# Altium schematic sheet PowerSupply.SchDoc
size A; SheetNumber: 2; SheetTotal: 5
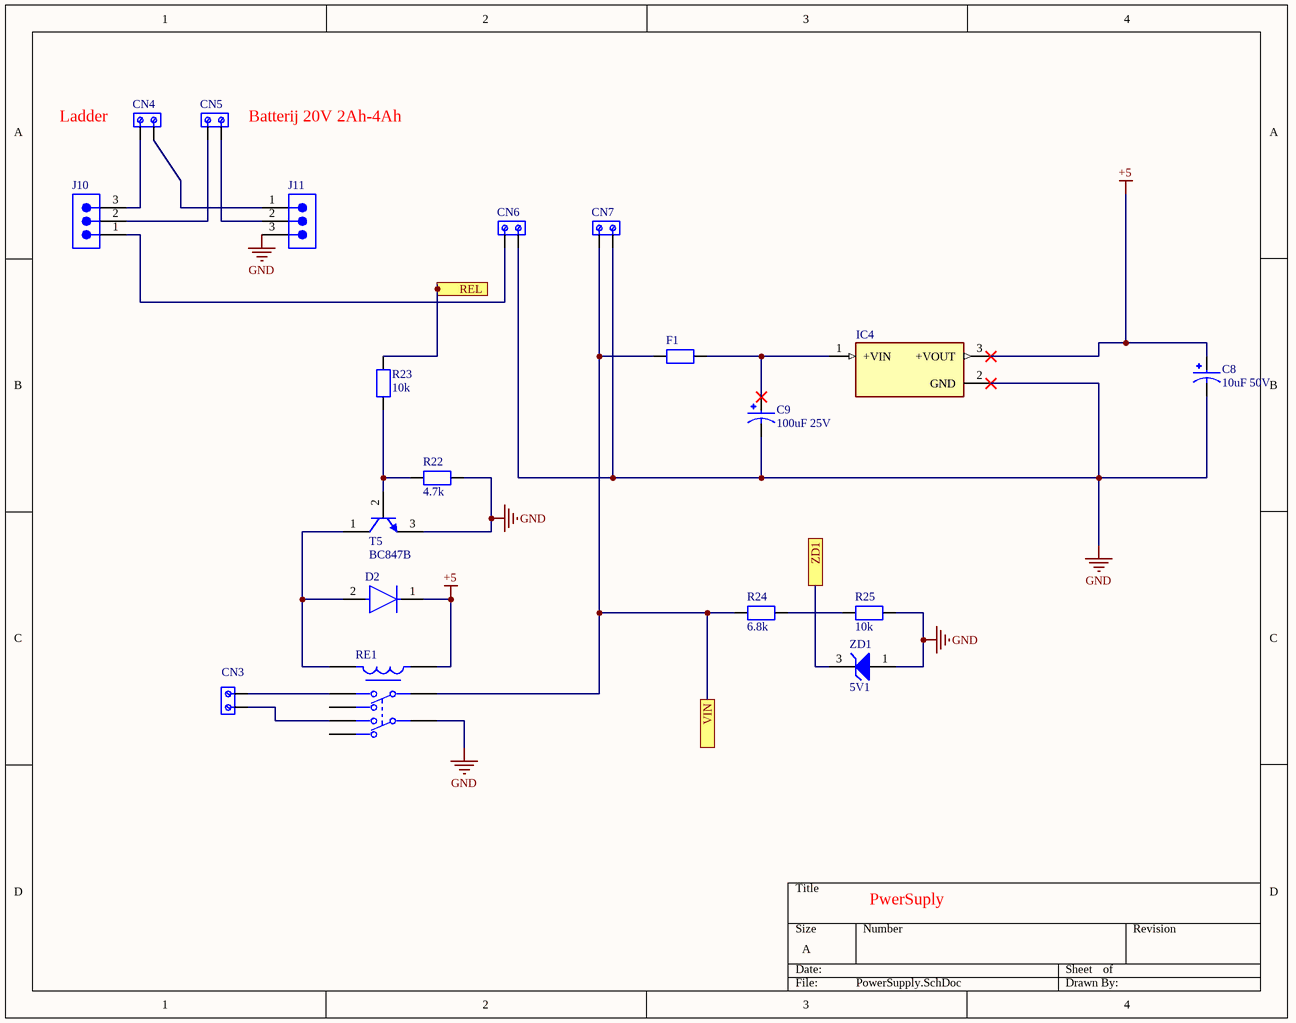
[diagram p0: PowerSupply.SchDoc]

## Parts
C8  10uF 50V  [CAPPRD350W60D800H1150]
C9  100uF 25V  [CAPPRD500W50D500H1100]
CN3  connecters 2pins  [conncecto 2 pins]  (value not drawn)
CN4  connecters 2pins  [conncecto 2 pins]  (value not drawn)
CN5  connecters 2pins  [conncecto 2 pins]  (value not drawn)
CN6  connecters 2pins  [conncecto 2 pins]  (value not drawn)
CN7  connecters 2pins  [conncecto 2 pins]  (value not drawn)
D2  1N4007  [FP-SOD323F-MFG]  (value not drawn)
F1  RES_0805  [RES_0805]  (value not drawn)
IC4  DC/DC converters  [CONV_TSR_1-2450E]  (value not drawn)
J10  61300311121  [61300311121]  (value not drawn)
J11  61300311121  [61300311121]  (value not drawn)
R22  4.7k  [RES_0805]
R23  10k  [RES_0805]
R24  6.8k  [RES_0805]
R25  10k  [RES_0805]
RE1  RT424005F  [FP-RT424005F-MFG]  (value not drawn)
T5  BC847B  [ONSC-TO-92-3-29-11]
ZD1  5V1  [ONSC-SOT-23-3-318-08_V]

## Ports
REL (see CPU[1C]), VIN (see PWU[2B]), ZD1 (see CPU[2B])

## Nets
+5: C8.P D2.1(C) IC4.3(+VOUT) RE1.A1
GND: C8.N C9.N CN6.2 CN7.2 IC4.2(GND) J11.3 R22.2 R25.2 RE1.21 T5.3(E) ZD1.1(A)
REL: R23.2 ; port REL
VIN: CN7.1 F1.1 R24.1 RE1.11 ; port VIN
ZD1: ZD1.3(K) ; port ZD1
NetC9_P: C9.P F1.2 IC4.1(+VIN)
NetCN3_1: CN3.1 RE1.24
NetCN3_2: CN3.2 RE1.14
NetCN4_1: CN4.1 J10.3
NetCN4_2: CN4.2 J11.1
NetCN5_1: CN5.1 J10.2
NetCN5_2: CN5.2 J11.2
NetCN6_1: CN6.1 J10.1
NetD2_2: D2.2(A) RE1.A2 T5.1(C)
NetR22_1: R22.1 R23.1 T5.2(B)
NetR24_2: R24.2 R25.1

Not connected (* = marked no-connect by the designer): RE1 12 22

## Notes on the sheet
- (near CN4) Ladder
- (near CN5) Batterij 20V 2Ah-4Ah
- PwerSuply

## Library data of the parts
C8 = Capacitor: Capacitor 100 μF, 50 V, steek 3,5 mm, 8x11 mm, generic.
C9 = Capacitor_1: Capacitor, 10 μF, 50 V, steek 2 mm, 5x11 mm, generic.
CN3-CN7 = pins: printkroonsteen 5,08 mm,
D2 = 1N4148WSF-7: Rectifier Diode, 1 Phase, 1 Element, 0.25A, 100V V(RRM), Silicon; Manufacturer: Diodes; Package Body Material: Plastic; Number of Elements: 1; Max Output current: 250mA; Max Power Dissipation: 400mW; Reverse Recovery Time-Max: 0.004us; Supplier: Future Electronics; Supplier Part Number: 4050038; Manufacturer Part Number: 1N4148WSF-7; RoHS: Yes; Category: Rectifier Diodes; Stock: 36000; Pricing: 3000=0.0178, 12000=0.0171, 45000=0.0164, 90000=0.0161, 225000=0.0153 (USD); Pins: 2; Diode Element Material: SILICON; Package Shape: Rectangular; Terminal Finish: Tin; Min Operating Temperature: -55°C; Max Operating Temperature: 150°C; JESD-609 Code: e3; Diode Type: RECTIFIER; JESD-30 Code: R-PDSO-F2; Package Style: SMALL OUTLINEMeter; Rep Pk Reverse Voltage-Max: 100V; Surface Mount: Yes; Terminal Form: Flat; Terminal Position: DUAL; Reach SVHC Compliant: Yes; RoHS Compliant: Yes; ComponentLink1URL: https://datasheet.ciiva.com:443/pdfs/VipMasterIC/IC/DIOD/DIODS20288/DIODS20288-1.pdf?src-supplier=IHS+Markit; ComponentLink1Description: https://datasheet.ciiva.com:443/pdfs/VipMasterIC/IC/DIOD/DIODS20288/DIODS20288-1.pdf?src-supplier=IHS+Markit; ComponentLink2URL: https://datasheet.ciiva.com/29592/1n4148wsf-29592065.pdf?src-supplier=Digikey; ComponentLink2Description: https://datasheet.ciiva.com/29592/1n4148wsf-29592065.pdf?src-supplier=Digikey
F1 R22-R25 = RES_0805: SMD size 0805 Generic.; Manufacturer: *; Manufacture Part N: *; Tolerence: *; Package Size: *; Voltage Rating: *
J10 J11 = 61300311121: Board Connector, 3 Contact(s), 1 Row(s), Male, Straight, 0.1 inch Pitch, Solder Terminal, Locking, Black Insulator, Plug; Manufacturer: Wurth Electronics; Contact Pattern: RECTANGULAR; Contact Resistance: 20mR; Contact Style: SQ PIN-SKT; Dielectric Withstanding Voltage (AC): 500V; Insulation Resistance: 1GR; Number Of Connectors: 1; Rated Current (Signal): 3A; Number of Contacts: 3; Body Length: 0.3inch; Reference Standard: UL; Reliability: COMMERCIAL; Supplier: Rs; Supplier Part Number: 8281585P; Manufacturer Part Number: 61300311121; RoHS: Yes; Category: Connectors; Stock: 3960; Pricing: 25=0.11, 50=0.088, 100=0.082, 250=0.078 (EUR); Mounting Technology: Board; Contact Material: Copper Alloy; Contact Finish - Mating: GOLD; Contact Finish - Termination: Gold (Au) - with Nickel (Ni) barrier; Insulation Color: Black; Insulation Material: Polybutylene; Min Operating Temperature: -40°C; Max Operating Temperature: 125°C; Connector Type: BOARD CONNECTOR; JESD-609 Code: e4; Body/Shell Style: PLUG; Contact Gender: Male; Mounting Style: STRAIGHT; Number of Rows Loaded: 1; PCB Contact Pattern: RECTANGULAR; Termination: Solder; Body Breadth: 0.1inch; Body Depth: 0.1inch; Mating Contact Pitch: 0.1inch; Mounting Option 1: LOCKING; Terminal Length: 0.118inch; Terminal Pitch: 2.54mm; Reach SVHC Compliant: Yes; RoHS Compliant: Yes; ComponentLink1URL: https://datasheet.ciiva.com:443/pdfs/VipMasterIC/IC/MIDC/MIDCS07676/MIDCS07676-1.pdf?src-supplier=IHS+Markit; ComponentLink1Description: https://datasheet.ciiva.com:443/pdfs/VipMasterIC/IC/MIDC/MIDCS07676/MIDCS07676-1.pdf?src-supplier=IHS+Markit; ComponentLink2URL: http://www.farnell.com/cad/1737268.pdf?src-supplier=Element14; ComponentLink2Description: http://www.farnell.com/cad/1737268.pdf?src-supplier=Element14; ComponentLink3URL: https://datasheet.octopart.com/61300311121-W%C3%BCrth-Elektronik-datasheet-21154836.pdf?src-supplier=Element14; ComponentLink3Description: https://datasheet.octopart.com/61300311121-W%C3%BCrth-Elektronik-datasheet-21154836.pdf?src-supplier=Element14; ComponentLink4URL: https://katalog.we-online.de/em/datasheet/6130xx11121.pdf?src-supplier=Digikey; ComponentLink4Description: https://katalog.we-online.de/em/datasheet/6130xx11121.pdf?src-supplier=Digikey
RE1 = RT424005F: Power/Signal Relay, 2 Form C, DPDT, Momentary, 0.08A (Coil), 5VDC (Coil), 400mW (Coil), 8A (Contact), 30VDC (Contact), DC Input, Random, AC Output, Through Hole-Straight Mount; Manufacturer: TE Connectivity; End Contact Material: Agni90/10; Coil Current(DC)-Max: 80mA; Coil Operate Voltage(DC): 3.5V; Coil Release Voltage(DC): 500mV; Coil Resistance: 62R; Coil Voltage(DC)-Max: 5V; Contact AC Max Power Rating R Load: 2000VA@400VAC; Contact AC Max Rating R Load: 8A@250VAC; Contact DC Max Rating R Load: 8A@30VDC; Contact Voltage(AC)-Max: 250V; Contact Voltage(DC)-Max: 30V; Dielectric Strength Between Coil and Contacts: 5000Vrms; Dielectric Strength Between Open Contacts: 1000Vrms; Electrical Life: 30000Cycles; Operate Time: 15ms; PCB Hole Count: 8; Relay Form: 2 FORM C; Release Time: 6ms; Body Breadth: 12.7inch; Body Height: 15.7mm; Body Length or Diameter: 29mm; Reference Standard: UL; Sealing: FLUX FREE SEALED; Supplier: Avnet; Supplier Part Number: 17C6452; Manufacturer Part Number: RT424005F; RoHS: Yes; Category: Power Relays; Stock: 1500; Pricing: 1=6.31, 10=5.95, 25=5.33, 50=5.1, 100=4.86 (USD); Mounting Technology: Through Hole; Pins: 8; Weight: 13g; Min Operating Temperature: -40°C; Max Operating Temperature: 85°C; Coil Power: 400mW; Coil Voltage-Nom: 5V; Coil/Input Supply Type: DC; Contact Current(AC)-Max: 8A; Contact Current(DC)-Max: 8A; Contact/Output Supply Type: AC; Input Switching Control Type: Random; Packaging: Box; Relay Action: MOMENTARY; Relay Function: DPDT; Relay Type: POWER/SIGNAL RELAY; Termination: Solder; Terminal Length: 0.0036inch; Reach SVHC Compliant: Yes; RoHS Compliant: Yes; ComponentLink1URL: https://datasheet.ciiva.com:443/pdfs/VipMasterIC/IC/TYEL/TYEL-S-A0008743874/TYEL-S-A0008744021-1.pdf?src-supplier=IHS+Markit; ComponentLink1Description: https://datasheet.ciiva.com:443/pdfs/VipMasterIC/IC/TYEL/TYEL-S-A0008743874/TYEL-S-A0008744021-1.pdf?src-supplier=IHS+Markit; ComponentLink2URL: https://datasheet.ciiva.com/2408/eng-ds-rt2pb-0411-2408708.pdf?src-supplier=Digikey; ComponentLink2Description: https://datasheet.ciiva.com/2408/eng-ds-rt2pb-0411-2408708.pdf?src-supplier=Digikey
T5 = BC547CG: Small Signal Bipolar Transistor, 0.1A I(C), 45V V(BR)CEO, 1-Element, NPN, Silicon, TO-92; Manufacturer: ON Semiconductor; Package Body Material: Plastic; Max Collector Current: 100mA; DC Current Gain-Min (hFE): 420; Number of Elements: 1; Power Dissipation-Max (Abs): 625mW; Surface Mount: No; Time @ Peak Reflow Temperature-Max (s): 40s; Transistor Application: AMPLIFIER; Frequency: 300MHz; Qualification Status: Not Qualified; Supplier: Arrow Electronics; Supplier Part Number: BC547CG; Manufacturer Part Number: BC547CG; RoHS: Yes; Category: BJTs; Stock: 41483; Pricing: 1=0.214, 25=0.189, 100=0.169, 500=0.16, 1000=0.107, 2500=0.092, 5000=0.08, 10000=0.064, 25000=0.062 (USD); Pins: 3; Package Shape: Round; Terminal Finish: Copper; Transistor Element Material: SILICON; Max Operating Temperature: 150°C; JESD-609 Code: e1; Polarity/Channel Type: NPN; Collector-emitter Voltage-Max: 45V; JESD-30 Code: O-PBCY-T3; Package Style: CYLINDRICALMeter; Peak Reflow Temperature (Cel): 260°C; Terminal Form: Through Hole; Terminal Position: BOTTOM; RoHS Compliant: Yes; Reach SVHC Compliant: Yes; JEDEC-95 Code: TO-92; ComponentLink1URL: https://datasheet.ciiva.com:443/pdfs/VipMasterIC/IC/ONSM/ONSMS24464/ONSMS24464-1.pdf?src-supplier=IHS+Markit; ComponentLink1Description: https://datasheet.ciiva.com:443/pdfs/VipMasterIC/IC/ONSM/ONSMS24464/ONSMS24464-1.pdf?src-supplier=IHS+Markit; ComponentLink2URL: https://datasheet.ciiva.com/977/bc546-d-977051.pdf?src-supplier=Digikey; ComponentLink2Description: https://datasheet.ciiva.com/977/bc546-d-977051.pdf?src-supplier=Digikey
ZD1 = MMBZ5231BLT1G: Zener Diode, 5.1V V(Z), 5.1%, 0.225W, Silicon, Unidirectional, TO-236AB; Manufacturer: ON Semiconductor; Package Body Material: Plastic; Dynamic Impedance-Max: 17R; Number of Elements: 1; Max Power Dissipation: 225mW; Test Current: 20mA; Time @ Peak Reflow Temperature-Max (s): 40s; Qualification Status: Not Qualified; Supplier: Future Electronics; Supplier Part Number: 8481582; Manufacturer Part Number: MMBZ5231BLT1G; RoHS: Yes; Category: Zener Diodes; Stock: 543000; Pricing: 3000=0.014, 12000=0.0134, 30000=0.013, 75000=0.0127, 120000=0.0121 (USD); Pins: 3; Terminal Finish: Tin; Diode Element Material: SILICON; Package Shape: Rectangular; Min Operating Temperature: -65°C; Max Operating Temperature: 150°C; JESD-609 Code: e3; Diode Type: ZENER; Reference Voltage-Nom: 5.1V; Surface Mount: Yes; Voltage Tol-Max: 5.1%; Polarity: Unidirectional; Moisture Sensitivity Level: 1; Package Style: SMALL OUTLINEMeter; Technology: ZENER; Terminal Form: Gull Wing; Terminal Position: DUAL; JESD-30 Code: R-PDSO-G3; Peak Reflow Temperature (Cel): 260°C; Reach SVHC Compliant: Yes; RoHS Compliant: Yes; JEDEC-95 Code: TO-236AB; ComponentLink1URL: https://datasheet.ciiva.com:443/pdfs/VipMasterIC/IC/ONSM/ONSM-S-A0002808860/ONSM-S-A0002808860-1.pdf?src-supplier=IHS+Markit; ComponentLink1Description: https://datasheet.ciiva.com:443/pdfs/VipMasterIC/IC/ONSM/ONSM-S-A0002808860/ONSM-S-A0002808860-1.pdf?src-supplier=IHS+Markit